# Altium project Final decision and led power V2.PrjPcb
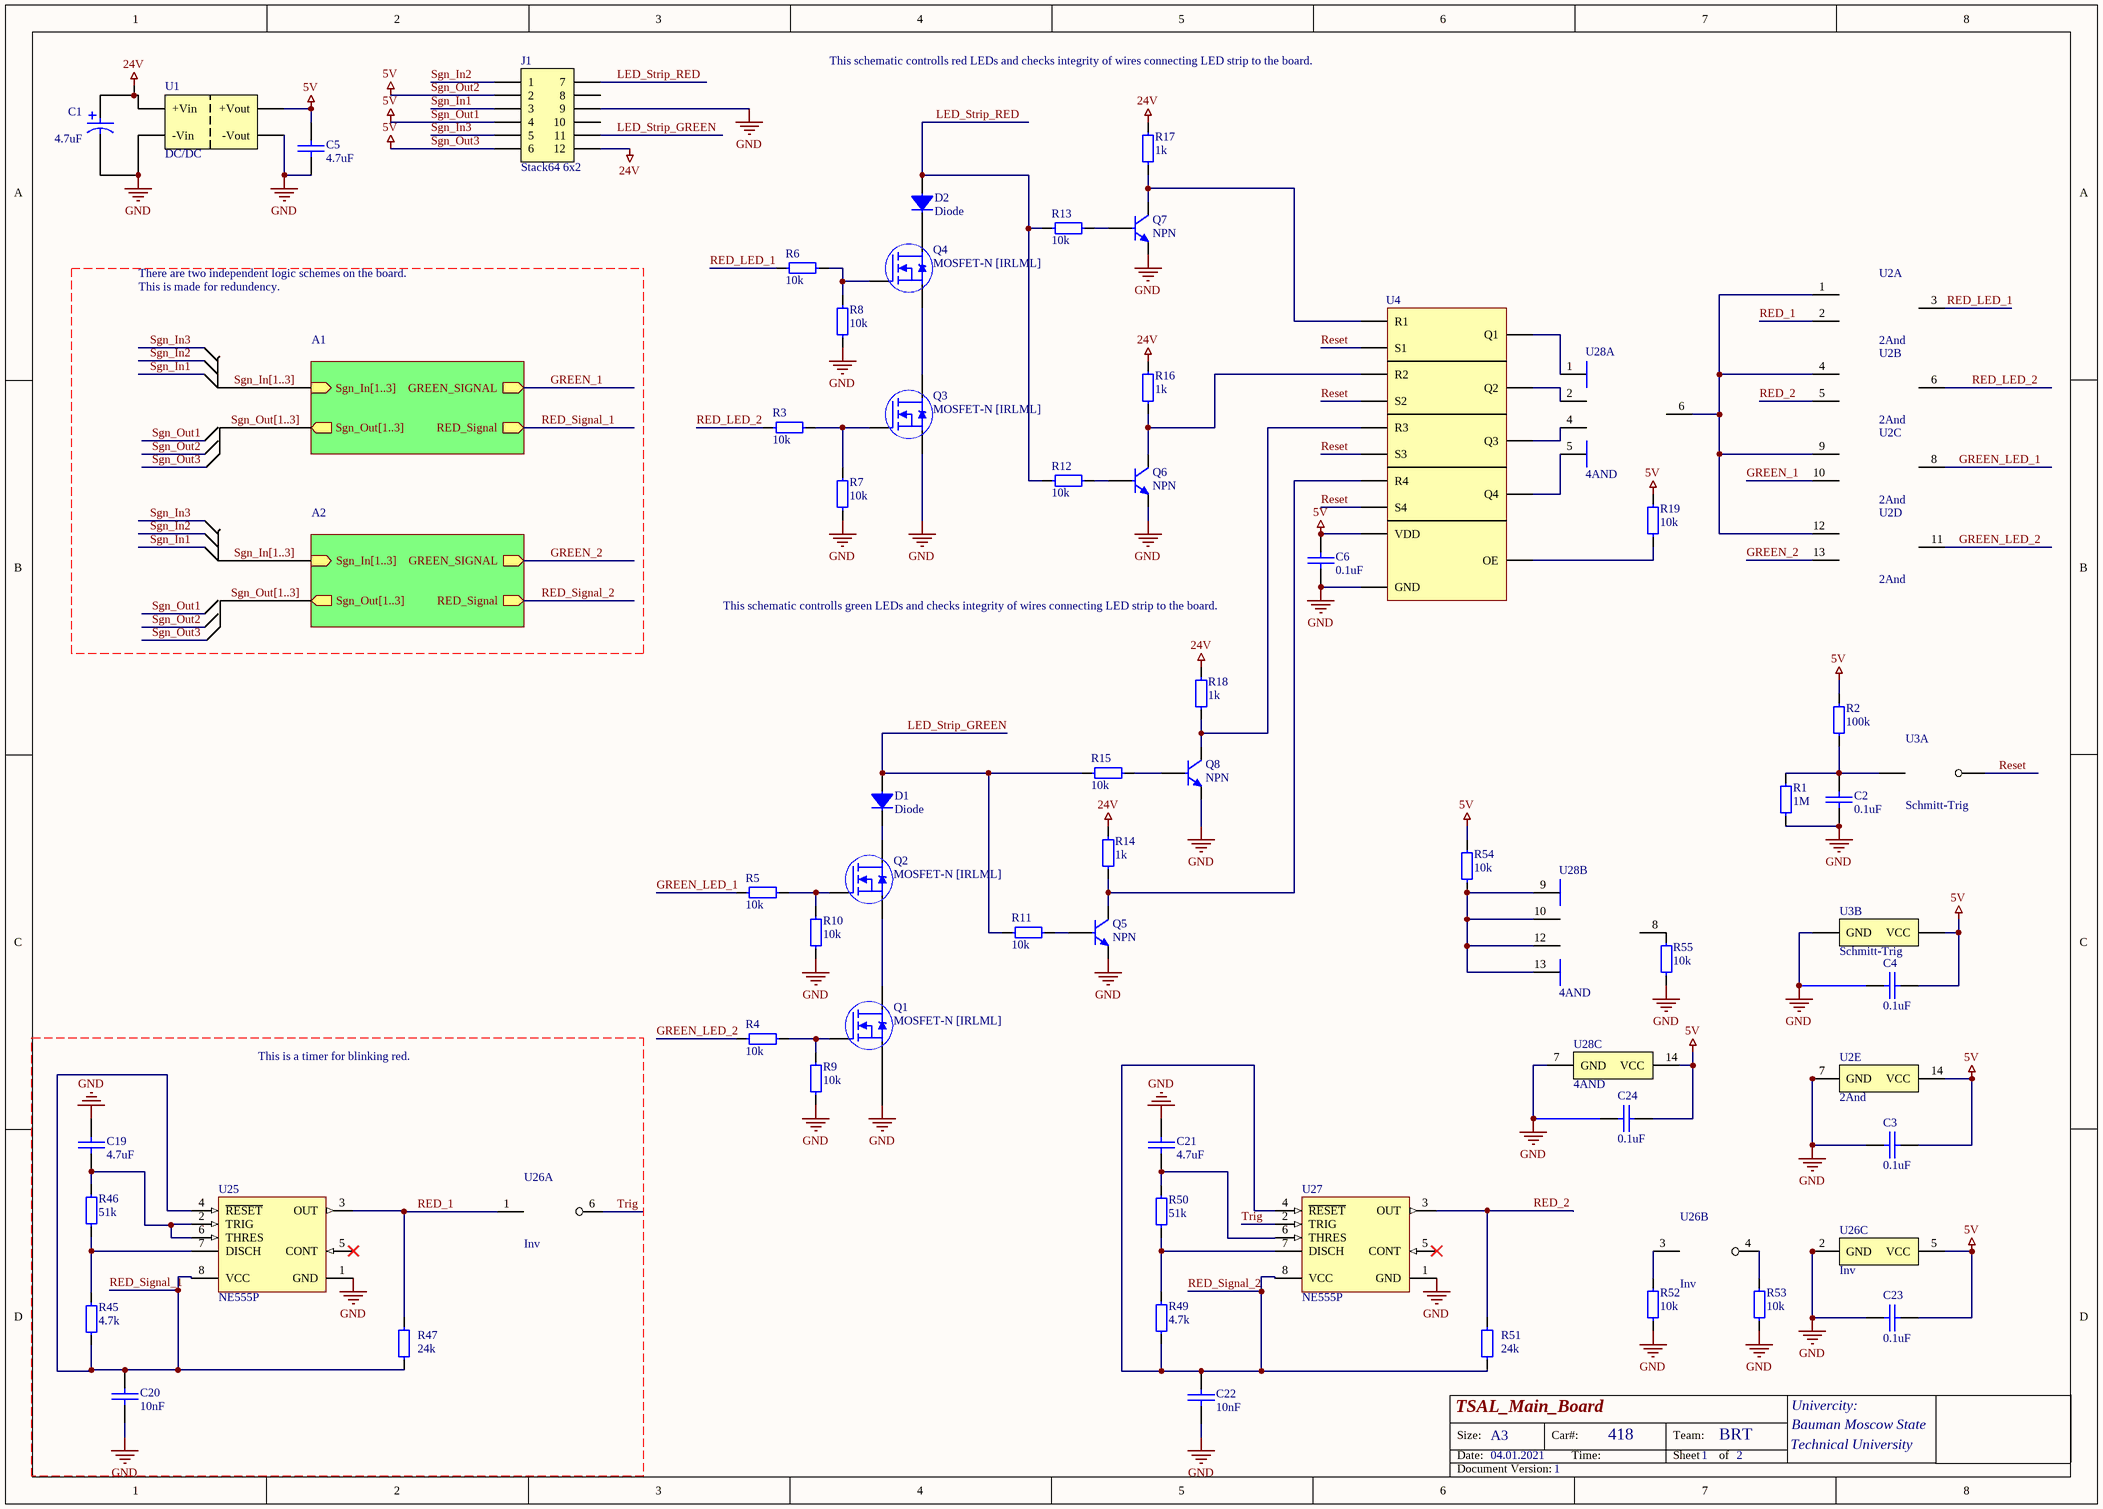
[diagram p0: Sheet1 V2.SchDoc]
2 sheets, 176 parts. Net scope: hierarchical (ports join the sheet entries above them; power ports are global).
Board files: Final decision V4.PcbDoc, Final decision V5.PcbDoc
Sheets:
  Sheet1 V2.SchDoc
    A1 = SignalReciever.SchDoc
    A2 = SignalReciever.SchDoc

## Sheet Sheet1 V2.SchDoc
size A3; Date: 04.01.2021; Organization: Altium Limited; Address1: L3, 12a Rodborough Rd; Address2: Frenchs Forest; Address3: NSW; Address4: Australia 2086; SheetNumber: 1; SheetTotal: 2; Version: 1; Название устройства: TSAL_Main_Board

### Parts
(Parts that share a designator on the sheet are numbered #1, #2 ... from top to bottom, then left to right.)
C1  4.7uF  [Bar Cap 4x5.4]
C2  0.1uF  [0603 Capicator]
C3#1  0.1uF  [0603 Capicator]
C4#1  0.1uF  [0603 Capicator]
C5#1  4.7uF  [0603 Capicator]
C6#1  0.1uF  [0603 Capicator]
C19  4.7uF  [0603 Capicator]
C20  10nF  [0603 Capicator]
C21  4.7uF  [0603 Capicator]
C22  10nF  [0603 Capicator]
C23  0.1uF  [0603 Capicator]
C24  0.1uF  [0603 Capicator]
D1  Diode  [DO-214AB(SMC)]
D2  Diode  [DO-214AB(SMC)]
J1  Stack64 6x2  [Conn6x2(Molex)]
Q1  MOSFET-N [IRLML]  [SOT-23]
Q2  MOSFET-N [IRLML]  [SOT-23]
Q3  MOSFET-N [IRLML]  [SOT-23]
Q4  MOSFET-N [IRLML]  [SOT-23]
Q5  NPN  [SOT-23]
Q6  NPN  [SOT-23]
Q7  NPN  [SOT-23]
Q8  NPN  [SOT-23]
R1  1M  [0603 Resistor]
R2  100k  [0603 Resistor]
R3  10k  [0603 Resistor]
R4  10k  [0603 Resistor]
R5  10k  [0603 Resistor]
R6  10k  [0603 Resistor]
R7  10k  [0603 Resistor]
R8  10k  [0603 Resistor]
R9  10k  [0603 Resistor]
R10  10k  [0603 Resistor]
R11  10k  [0603 Resistor]
R12  10k  [0603 Resistor]
R13  10k  [0603 Resistor]
R14  1k  [0603 Resistor]
R15  10k  [0805 Resistor]
R16  1k  [0603 Resistor]
R17#1  1k  [0603 Resistor]
R18#1  1k  [0603 Resistor]
R19#1  10k  [0603 Resistor]
R45  4.7k  [0603 Resistor]
R46  51k  [0603 Resistor]
R47  24k  [0805 Resistor]
R49  4.7k  [0603 Resistor]
R50  51k  [0603 Resistor]
R51  24k  [0805 Resistor]
R52  10k  [0603 Resistor]
R53  10k  [0603 Resistor]
R54  10k  [0603 Resistor]
R55  10k  [0603 Resistor]
U1  DC/DC  [SIP7]
U2  2And  [SOIC-14]  (parts A,B,C,D,E of 5)
U3  Schmitt-Trig  [SOT-23-5]  (parts A,B of 2)
U4  quad R/S latch with 3-state outputs  [SOIC-16]  (value not drawn)
U25  NE555P  [SOIC-8]
U26  Inv  [SOT236]  (parts A,B,C of 3)
U27  NE555P  [SOIC-8]
U28#1  4AND  [SOIC-14]  (parts A,B,C of 3)

### Sub-sheets
A1 = SignalReciever.SchDoc: RED_Signal (out), GREEN_SIGNAL (out), Sgn_In[1..3] (in), Sgn_Out[1..3] (out)
A2 = SignalReciever.SchDoc: RED_Signal (out), GREEN_SIGNAL (out), Sgn_In[1..3] (in), Sgn_Out[1..3] (out)

### Nets
24V: C1.2 J1.12 R14.2 R16.2 R17#1.2 R18#1.2 U1.1(+Vin)
GND: C1.1 C2.1 C3#1.1 C4#1.1 C5#1.1 C6#1.1 C19.2 C20.1 C21.2 C22.1 C23.1 C24.1 J1.9 Q1.2(Source) Q3.2(Source) Q5.2 Q6.2 Q7.2 Q8.2 R1.1 R7.1 R8.1 R9.1 R10.1 R52.1 R53.2 R55.2 U1.2(-Vin) U1.4(-Vout) U2.7(GND) U3.3(GND) U4.16(GND) U25.1(GND) U26.2(GND) U27.1(GND) U28#1.7(GND)
Sgn_Out1: C3#1.2 C4#1.2 C5#1.2 C6#1.2 C23.2 C24.2 J1.2 J1.4 J1.6 R2.2 R19#1.1 R54.1 U1.6(+Vout) U2.14(VCC) U3.5(VCC) U4.8(VDD) U26.5(VCC) U28#1.14(VCC)  [also labelled 5V, Sgn_Out2, Sgn_Out3]
GREEN_1: U2.10(3B) ; sheet A1/GREEN_SIGNAL
GREEN_2: U2.13(4B) ; sheet A2/GREEN_SIGNAL
GREEN_LED_1: R5.2 U2.8(3Y)
GREEN_LED_2: R4.2 U2.11(4Y)
LED_Strip_GREEN: D1.1 J1.11 R11.2 R15.2
LED_Strip_RED: D2.1 J1.7 R12.2 R13.2
RED_1: R47.2 U2.2(1B) U25.3(OUT) U26.1(1A)
RED_2: R51.2 U2.5(2B) U27.3(OUT)
RED_LED_1: R6.2 U2.3(1Y)
RED_LED_2: R3.2 U2.6(2Y)
RED_Signal_1: C20.2 R45.1 R47.1 U25.4(~{RESET}) U25.8(VCC) ; sheet A1/RED_Signal
RED_Signal_2: C22.2 R49.1 R51.1 U27.4(~{RESET}) U27.8(VCC) ; sheet A2/RED_Signal
Reset: U3.4(Y) U4.4(S1) U4.6(S2) U4.12(S3) U4.14(S4)
Sgn_In1: J1.3
Sgn_In2: J1.1
Sgn_In3: J1.5
Trig: U26.6(1Y) U27.2(TRIG)
NetC2_2: C2.2 R1.2 R2.1 U3.2(in)
NetC19_1: C19.1 R46.2 U25.2(TRIG) U25.6(THRES)
NetC21_1: C21.1 R50.2 U27.6(THRES)
NetD1_2: D1.2 Q2.3(Drain)
NetD2_2: D2.2 Q4.3(Drain)
NetQ1_1: Q1.1(Gate) R4.1 R9.2
NetQ1_3: Q1.3(Drain) Q2.2(Source)
NetQ2_1: Q2.1(Gate) R5.1 R10.2
NetQ3_1: Q3.1(Gate) R3.1 R7.2
NetQ3_3: Q3.3(Drain) Q4.2(Source)
NetQ4_1: Q4.1(Gate) R6.1 R8.2
NetQ5_1: Q5.1 R11.1
NetQ5_3: Q5.3 R14.1 U4.15(R4)
NetQ6_1: Q6.1 R12.1
NetQ6_3: Q6.3 R16.1 U4.7(R2)
NetQ7_1: Q7.1 R13.1
NetQ7_3: Q7.3 R17#1.1 U4.3(R1)
NetQ8_1: Q8.1 R15.1
NetQ8_3: Q8.3 R18#1.1 U4.11(R3)
NetR19#1_2: R19#1.2 U4.5(OE)
NetR45_2: R45.2 R46.1 U25.7(DISCH)
NetR49_2: R49.2 R50.1 U27.7(DISCH)
NetR52_2: R52.2 U26.3(2А)
NetR53_1: R53.1 U26.4(2Y)
NetR54_2: R54.2 U28#1.9(A) U28#1.10(B) U28#1.12(C) U28#1.13(D)
NetR55_1: R55.1 U28#1.8(Y)
NetU2_1: U2.1(1A) U2.4(2A) U2.9(3A) U2.12(4A) U28#1.6(Y)
NetU4_1: U4.1(Q4) U28#1.5(D)
NetU4_2: U4.2(Q1) U28#1.1(A)
NetU4_9: U4.9(Q2) U28#1.2(B)
NetU4_10: U4.10(Q3) U28#1.4(C)

Not connected (* = marked no-connect by the designer): J1 8 10; U25 5(CONT)*; U27 5(CONT)*

### Buses and harness runs
bus Sgn_In[1..3] = sheet A1/Sgn_In[1..3]
bus Sgn_In[1..3] = sheet A2/Sgn_In[1..3]
bus Sgn_Out[1..3] = sheet A1/Sgn_Out[1..3]
bus Sgn_Out[1..3] = sheet A2/Sgn_Out[1..3]

### Notes on the sheet
- This schematic controlls red LEDs and checks integrity of wires connecting LED strip to the board.
- There are two independent logic schemes on the board.
- This is made for redundency.
- (near C6#1) This schematic controlls green LEDs and checks integrity of wires connecting LED strip to the board.
- This is a timer for blinking red.
- Size:
- Date:
- A3
- Car#:
- Time:
- 418
- Team:
- Sheet
- BRT
- of
- Technical University
- Univercity:
- Bauman Moscow State
- Document Version:

### Library data of the parts
C1 = Cap Pol 4.7uF: ECAP SMD,  35V, 105°C; Part Number: B41121A7475M000; Manufacturer: Epcos; Type: Capacitor; ComponentLink1Description: Chip&Dip; ComponentLink1URL: https://www.chipdip.ru/product/b41121a7475m000
C2 C3#1 C4#1 C6#1 C23 C24 = Cap 0.1uF (0603): 0.1uF X7R 16V 10% 0603; Manufacturer: Murata Manufacturing; Part Number: GRM188R71C104KA01D; Type: Capacitor; ComponentLink1Description: Chip&Dip; ComponentLink1URL: https://www.chipdip.ru/product/grm188r71c104ka01d
C5#1 C19 C21 = Cap 4.7uF (0603): 4.7uF X5R 25V 10% 0603; Manufacturer: Murata Manufacturing; Part Number: GRM188R61E475KE11D; Type: Capacitor; ComponentLink1Description: Chip&Dip; ComponentLink1URL: https://www.chipdip.ru/product0/9000348448
C20 C22 = Cap 10nF (0603): X7R 10nF 100V 10% 0603; Manufacturer: Murata Manufacturing; Part Number: GRM188R72A103KA01D; Type: Capacitor; ComponentLink1Description: Chip&Dip; ComponentLink1URL: https://www.chipdip.ru/product/grm188r72a103ka01d
D1 D2 = Diode (SMC): 3A 50V, (DO-214AB/SMC); Part Number: GS3A; Manufacturer: Yangzhou Yangjie Electronic Technology; Type: Diode; ComponentLink1Description: DataSheet; ComponentLink1URL: https://static.chipdip.ru/lib/152/DOC001152906.pdf; ComponentLink2Description: Chip&Dip; ComponentLink2URL: https://www.chipdip.ru/product/gs3a
J1 = Conn 12 [Stack64]: Stac64 Right-Angle Header Assembly, 12 Circuits, Polarization A, Black, Tray / Current - Maximum per Contact 10.0A / Voltage - Maximum 500V; ComponentLink1Description: Molex; ComponentLink1URL: https://www.molex.com/molex/products/part-detail/pcb_headers/0346910120; ComponentLink2Description: DataSheet; ComponentLink2URL: https://www.molex.com/webdocs/datasheets/pdf/en-us/0346910120_PCB_HEADERS.pdf
Q1-Q4 = MOSFET-N [IRLML]: VDS 30V,  VGS Max ± 20V, RDS 27-40mΩ,; Part Number: IRLML0030TRPBF; Manufacturer: Infineon Technologies; Type: Transistor; ComponentLink1Description: DataSheet; ComponentLink1URL: https://static.chipdip.ru/lib/300/DOC000300382.pdf; ComponentLink2Description: Chip&Dip; ComponentLink2URL: https://www.chipdip.ru/product/irlml0030trpbf
Q5-Q8 = NPN [BC817]: NPN general-purpose transistors; Part Number: BC817-40,215; Manufacturer: Nexperia; Type: Transistor; ComponentLink1Description: DataSheet; ComponentLink1URL: https://static.chipdip.ru/lib/156/DOC000156781.pdf; ComponentLink2Description: Chip&Dip; ComponentLink2URL: https://www.chipdip.ru/product/bc817-40
R1 = Res 1M (0603): 0.1W 0603 1M, 1%; Part Number: RC0603FR-071ML; Manufacturer: Taiwan; Type: Resistor; ComponentLink1Description: Chip&Dip; ComponentLink1URL: https://www.chipdip.ru/product0/9000079784
R2 = Res 100k (0603): 0.1W 0603 100k, 1%; Part Number: RC0603FR-07100KL; Manufacturer: Taiwan; Type: Resistor; ComponentLink1Description: Chip&Dip; ComponentLink1URL: https://www.chipdip.ru/product0/9000079760
R3-R13 R19#1 R52-R55 = Res 10k (0603): 0.1W 0603 10k, 1%; Part Number: RC0603FR-0710KL; Manufacturer: Taiwan; Type: Resistor; ComponentLink1Description: Chip&Dip; ComponentLink1URL: https://www.chipdip.ru/product0/9000079736
R14 R16 R17#1 R18#1 = Res 1k (0603): 0.1W 0603 1k, 1%; Part Number: RC0603FR-071KL; Manufacturer: Taiwan; Type: Resistor; ComponentLink1Description: Chip&Dip; ComponentLink1URL: https://www.chipdip.ru/product0/9000079676
R15 = Res 10k (0805): 0.125W 0805 10k, 1%; Part Number: RC0805FR-0710KL; Manufacturer: Taiwan; Type: Resistor; ComponentLink1Description: Chip&Dip; ComponentLink1URL: https://www.chipdip.ru/product0/9000079514
R45 R49 = Res 4.7k (0603): 0.1W 0603 4.7k, 1%; Part Number: RC0603FR-074K7L; Manufacturer: Taiwan; Type: Resistor; ComponentLink1Description: Chip&Dip; ComponentLink1URL: https://www.chipdip.ru/product0/9000079728
R46 R50 = Res 51k (0603): 0.1W 0603 51k, 1%; Part Number: RC0603FR-0751KL; Manufacturer: Taiwan; Type: Resistor; ComponentLink1Description: Chip&Dip; ComponentLink1URL: https://www.chipdip.ru/product0/9000079753
R47 R51 = Res 24k (0805): 0.125W 0805 24k, 1%; Part Number: RC0805FR-0724KL; Manufacturer: Taiwan; Type: Resistor; ComponentLink1Description: Chip&Dip; ComponentLink1URL: https://www.chipdip.ru/product0/9000079523
U1 = DC/DC Isolated 24V-5V [TMH]: The TMH series are ultra miniature, isolated 2 Watt DC/DC-converters in a Single-in-Line  package  (SIP); Manufacturer: Traco Power; Part Number: TMH2405S; ComponentLink1Description: Chip&Dip; ComponentLink1URL: https://www.chipdip.ru/product/tmh-2405s; ComponentLink2Description: DataSheet; ComponentLink2URL: https://static.chipdip.ru/lib/005/DOC001005854.pdf; Type: IC
U2 = 4(2And): 4 logic elements "2AND"; Part Number: SN74AC08DR; Manufacturer: Texas Instruments; ComponentLink1Description: DataSheet; ComponentLink1URL: https://static.chipdip.ru/lib/551/DOC001551527.pdf; ComponentLink2Description: Chip&Dip; ComponentLink2URL: https://www.chipdip.ru/product/sn74ac08dr; Type: IC
U3 = Schmitt Trigger [NC7SZ]: The NC7SZ14M5X is a single Inverter with Schmitt-trigger input from ultra-high speed (UHS) series of TinyLogic®. The device is fabricated with advanced CMOS technology to achieve ultra-high speed with high output drive while maintaining low static power dissipation over a very broad VCC operating range. The device is specified to operate over the 1.65 to 5.5V VCC range. The inputs and outputs are high-impedance when VCC is 0V. Inputs tolerate voltages up to 6V independent of VCC operating voltage.; Manufacturer: ON Semiconductor; Part Number: NC7SZ14M5X; ComponentLink1Description: DataSheet; ComponentLink1URL: https://static.chipdip.ru/lib/321/DOC000321280.pdf; ComponentLink2Description: Chip&Dip; ComponentLink2URL: https://www.chipdip.ru/product/nc7sz14m5x; Type: IC
U4 = 4 RS triggers: The HEF4043B is a quad R/S latch with 3-state outputs and common output enable input (OE).; ComponentLink1Description: Datasheet; ComponentLink1URL: https://static.chipdip.ru/lib/486/DOC014486419.pdf; ComponentLink2Description: CHIPDIP; ComponentLink2URL: https://www.chipdip.ru/product/hef4043bt-652-nexperia
U25 U27 = NE555P: Standard Timer Single 8-Pin PDIP Tube; Manufacturer: Texas Instruments; Min Supply Voltage: 4.5V; Max Supply Voltage: 16V; Frequency: 500kHz; Number of Timers/Counters: 1; High Level Output Current: -200mA; Low Level Output Current: 200mA; Nominal Supply Current: 2mA; Operating Supply Current: 10mA; Quiescent Current: 15mA; Operating Supply Voltage: 5V; Supplier 1: Digi-Key; Manufacturer Part Number: NE555P; RoHS: Yes; Category: Clock and Timing; Pricing 1: 1=0,37000, 10=0,29900, 25=0,27360, 100=0,20350, 250=0,18444, 500=0,15264, 1000=0,11448, 2500=0,10494, 5000=0,10020 (USD); Mount: SMD; Case/Package: PDIP; Number of Pins: 8; Weight: 0.015535oz; Contact Plating: Gold; Min Operating Temperature: 0°C; Max Operating Temperature: 70°C; Packaging: Rail/Tube; Package Quantity: 50; Current Rating: 10mA; Length: 9.81mm; Width: 6.35mm; Height: 4.57mm; Radiation Hardening: No; Lead Free: Lead Free; RoHS Compliant: Yes; REACH SVHC: No SVHC; ComponentLink1URL: https://datasheet.ciiva.com/1139/sa555-1139904.pdf?src-supplier=Element14; ComponentLink1Description: https://datasheet.ciiva.com/1139/sa555-1139904.pdf?src-supplier=Element14; ComponentLink2URL: https://datasheet.ciiva.com/19457/904085-19457361.pdf?src-supplier=Jameco; ComponentLink2Description: https://datasheet.ciiva.com/19457/904085-19457361.pdf?src-supplier=Jameco; ComponentLink3URL: https://datasheet.ciiva.com/26325/152184-da-01-en-ne555p-timer-tid-26325915.pdf?src-supplier=Conrad; ComponentLink3Description: https://datasheet.ciiva.com/26325/152184-da-01-en-ne555p-timer-tid-26325915.pdf?src-supplier=Conrad; ComponentLink4URL: https://datasheet.ciiva.com/1147/1764032-1147750.pdf?src-supplier=Newark; ComponentLink4Description: https://datasheet.ciiva.com/1147/1764032-1147750.pdf?src-supplier=Newark; ComponentLink5URL: https://datasheet.ciiva.com/14094/ne555-series-eng-tds-14094950.pdf?src-supplier=Distrelec; ComponentLink5Description: https://datasheet.ciiva.com/14094/ne555-series-eng-tds-14094950.pdf?src-supplier=Distrelec; ComponentLink6URL: https://datasheet.ciiva.com/14274/ne555-14274456.pdf?src-supplier=Avnet; ComponentLink6Description: https://datasheet.ciiva.com/14274/ne555-14274456.pdf?src-supplier=Avnet; ComponentLink7URL: https://datasheet.ciiva.com/15152/getdatasheetpartid-248510-15152620.pdf?src-supplier=Verical; ComponentLink7Description: https://datasheet.ciiva.com/15152/getdatasheetpartid-248510-15152620.pdf?src-supplier=Verical; ComponentLink8URL: https://datasheet.ciiva.com/1233/ne555-1233454.pdf?src-supplier=Digi-Key; ComponentLink8Description: https://datasheet.ciiva.com/1233/ne555-1233454.pdf?src-supplier=Digi-Key; ComponentLink9URL: https://datasheet.ciiva.com/26228/ne555-26228892.pdf?src-supplier=Avnet+Europe; ComponentLink9Description: https://datasheet.ciiva.com/26228/ne555-26228892.pdf?src-supplier=Avnet+Europe
U26 = Inverter (SN74): Dual inverter, 1.65-5.5V; Manufacturer: Texas Instruments; Part Number: SN74LVC2G04DBVR; ComponentLink1Description: Chip&Dip; ComponentLink1URL: https://www.chipdip.ru/product/sn74lvc2g04dbvr-2; ComponentLink2Description: DataSheet; ComponentLink2URL: https://static.chipdip.ru/lib/021/DOC001021810.pdf; Type: IC
U28#1 = 2(4AND): 2 logic elements "4AND"; Part Number: 74HC21D,653; Manufacturer: Nexperia; ComponentLink1Description: Chip&Dip; ComponentLink1URL: https://www.chipdip.ru/product/74hc21d.653; Type: IC; ComponentLink2Description: DataSheet; ComponentLink2URL: https://static.chipdip.ru/lib/522/DOC011522559.pdf

## Sheet SignalReciever.SchDoc
size A2; ENG_APP_DATE: --/--/--; DSN_APP_DATE: --/--/--; CHK_APP_DATE: --/--/--; Date: 04.01.2021; Organization: Altium Limited; Address1: L3, 12a Rodborough Rd; Address2: Frenchs Forest; Address3: NSW; Address4: Australia 2086; SheetNumber: 2; SheetTotal: 2; Название устройства: Reciever; Version: 1
Used 2 times, as channels A1, A2. Parts and nets are listed once, with the designators drawn on the sheet.
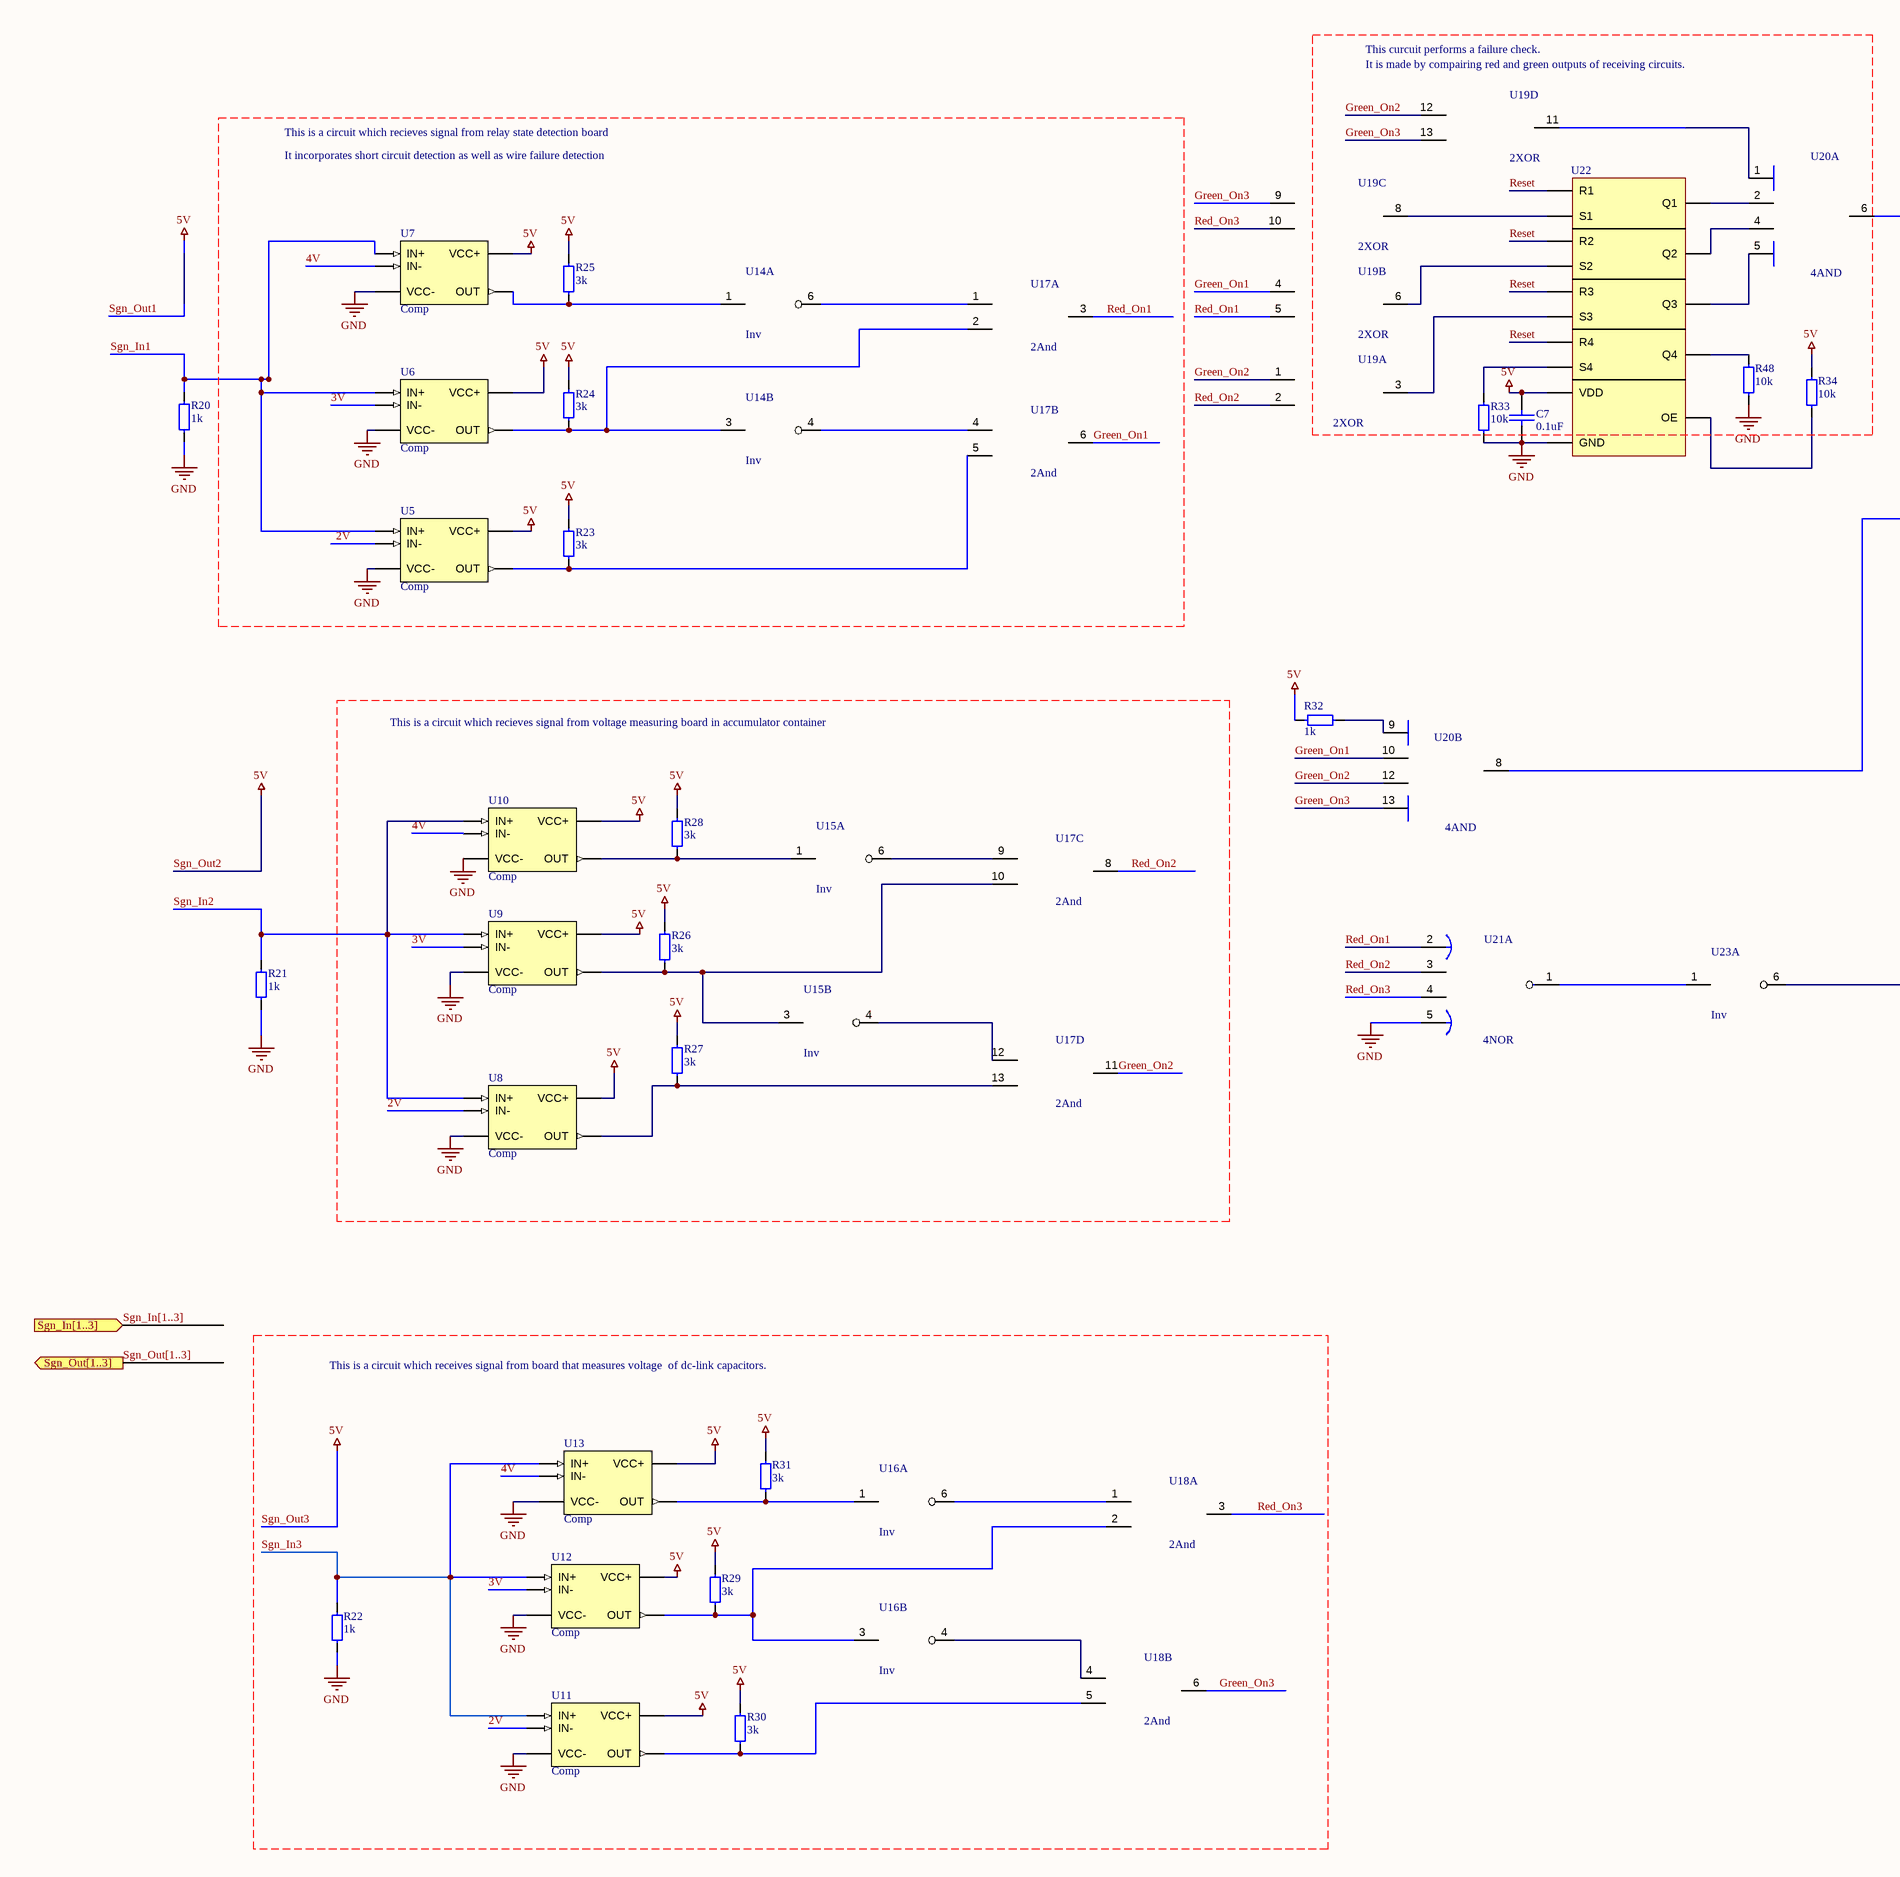
[diagram p1: SignalReciever.SchDoc, left]
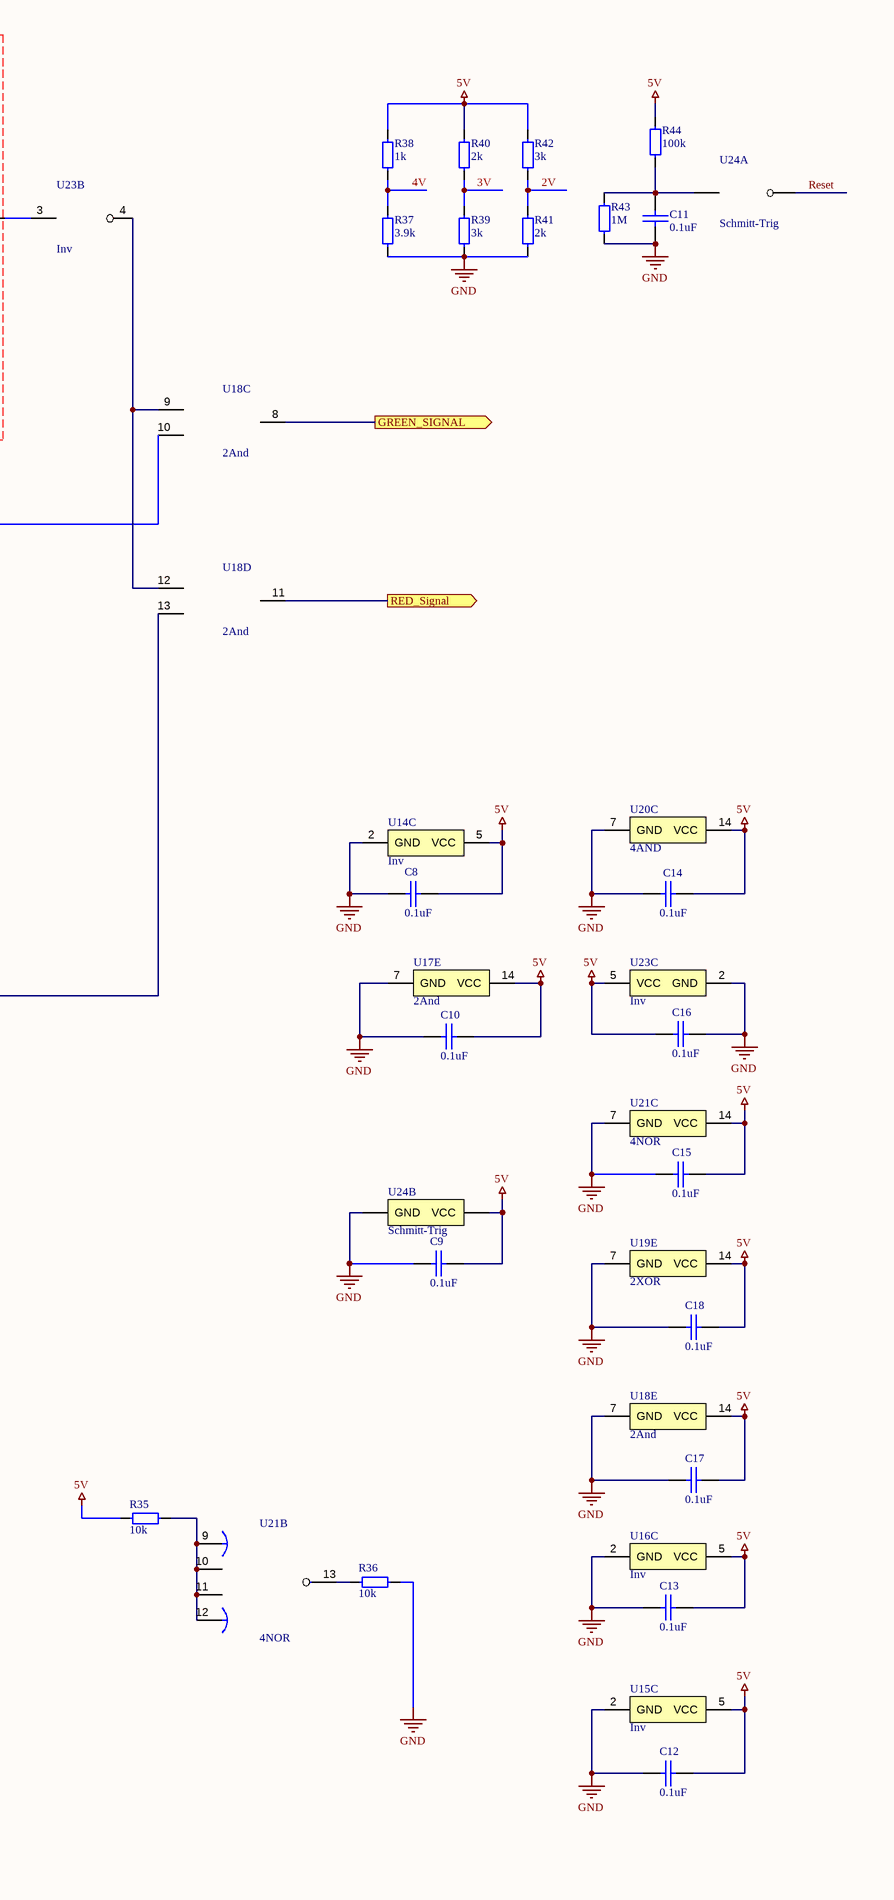
[diagram p2: SignalReciever.SchDoc, right]

### Parts
C7  0.1uF  [0603 Capicator]
C8  0.1uF  [0603 Capicator]
C9  0.1uF  [0603 Capicator]
C10  0.1uF  [0603 Capicator]
C11  0.1uF  [0603 Capicator]
C12  0.1uF  [0603 Capicator]
C13  0.1uF  [0603 Capicator]
C14  0.1uF  [0603 Capicator]
C15  0.1uF  [0603 Capicator]
C16  0.1uF  [0603 Capicator]
C17  0.1uF  [0603 Capicator]
C18  0.1uF  [0603 Capicator]
R20  1k  [0603 Resistor]
R21  1k  [0603 Resistor]
R22  1k  [0603 Resistor]
R23  3k  [0603 Resistor]
R24  3k  [0603 Resistor]
R25  3k  [0603 Resistor]
R26  3k  [0603 Resistor]
R27  3k  [0603 Resistor]
R28  3k  [0603 Resistor]
R29  3k  [0603 Resistor]
R30  3k  [0603 Resistor]
R31  3k  [0603 Resistor]
R32  1k  [0603 Resistor]
R33  10k  [0603 Resistor]
R34  10k  [0603 Resistor]
R35  10k  [0603 Resistor]
R36  10k  [0603 Resistor]
R37  3.9k  [0603 Resistor]
R38  1k  [0603 Resistor]
R39  3k  [0603 Resistor]
R40  2k  [0603 Resistor]
R41  2k  [0603 Resistor]
R42  3k  [0603 Resistor]
R43  1M  [0603 Resistor]
R44  100k  [0603 Resistor]
R48  10k  [0603 Resistor]
U5  Comp  [SOT-23-5]
U6  Comp  [SOT-23-5]
U7  Comp  [SOT-23-5]
U8  Comp  [SOT-23-5]
U9  Comp  [SOT-23-5]
U10  Comp  [SOT-23-5]
U11  Comp  [SOT-23-5]
U12  Comp  [SOT-23-5]
U13  Comp  [SOT-23-5]
U14  Inv  [SOT236]  (parts A,B,C of 3)
U15  Inv  [SOT236]  (parts A,B,C of 3)
U16  Inv  [SOT236]  (parts A,B,C of 3)
U17  2And  [SOIC-14]  (parts A,B,C,D,E of 5)
U18  2And  [SOIC-14]  (parts A,B,C,D,E of 5)
U19  2XOR  [SOIC-14]  (parts A,B,C,D,E of 5)
U20  4AND  [SOIC-14]  (parts A,B,C of 3)
U21  4NOR  [SOIC-14]  (parts A,B,C of 3)
U22  quad R/S latch with 3-state outputs  [SOIC-16]  (value not drawn)
U23  Inv  [SOT236]  (parts A,B,C of 3)
U24  Schmitt-Trig  [SOT-23-5]  (parts A,B of 2)

### Ports
GREEN_SIGNAL (out), RED_Signal (out), Sgn_In[1..3] (in), Sgn_Out[1..3] (out)

### Nets
GND: C7.1 C8.1 C9.1 C10.1 C11.1 C12.1 C13.1 C14.1 C15.1 C16.2 C17.1 C18.1 R20.1 R21.1 R22.1 R33.2 R36.2 R37.1 R39.1 R41.1 R43.1 R48.2 U5.2(VCC-) U6.2(VCC-) U7.2(VCC-) U8.2(VCC-) U9.2(VCC-) U10.2(VCC-) U11.2(VCC-) U12.2(VCC-) U13.2(VCC-) U14.2(GND) U15.2(GND) U16.2(GND) U17.7(GND) U18.7(GND) U19.7(GND) U20.7(GND) U21.5(D) U21.7(GND) U22.16(GND) U23.2(GND) U24.3(GND)
Sgn_Out1: C7.2 C8.2 C9.2 C10.2 C12.2 C13.2 C14.2 C15.2 C16.1 C17.2 C18.2 R23.2 R24.2 R25.2 R26.2 R27.2 R28.2 R29.2 R30.2 R31.2 R32.2 R34.1 R35.1 R38.1 R40.2 R42.2 R44.2 U5.5(VCC+) U6.5(VCC+) U7.5(VCC+) U8.5(VCC+) U9.5(VCC+) U10.5(VCC+) U11.5(VCC+) U12.5(VCC+) U13.5(VCC+) U14.5(VCC) U15.5(VCC) U16.5(VCC) U17.14(VCC) U18.14(VCC) U19.14(VCC) U20.14(VCC) U21.14(VCC) U22.8(VDD) U23.5(VCC) U24.5(VCC)  [also labelled 5V, Sgn_Out2, Sgn_Out3]
2V: R41.2 R42.1 U5.3(IN-) U8.3(IN-) U11.3(IN-)
3V: R39.2 R40.1 U6.3(IN-) U9.3(IN-) U12.3(IN-)
4V: R37.2 R38.2 U7.3(IN-) U10.3(IN-) U13.3(IN-)
Green_On1: U17.6(2Y) U19.4(A) U20.10(B)
Green_On2: U17.11(4Y) U19.1(A) U19.12(A) U20.12(C)
Green_On3: U18.6(2Y) U19.9(A) U19.13(B) U20.13(D)
GREEN_SIGNAL: U18.8(3Y) ; port GREEN_SIGNAL
Red_On1: U17.3(1Y) U19.5(B) U21.2(A)
Red_On2: U17.8(3Y) U19.2(B) U21.3(B)
Red_On3: U18.3(1Y) U19.10(B) U21.4(C)
RED_Signal: U18.11(4Y) ; port RED_Signal
Reset: U22.3(R1) U22.7(R2) U22.11(R3) U22.15(R4) U24.4(Y)
Sgn_In1: R20.2 U5.1(IN+) U6.1(IN+) U7.1(IN+)
Sgn_In2: R21.2 U8.1(IN+) U9.1(IN+) U10.1(IN+)
Sgn_In3: R22.2 U11.1(IN+) U12.1(IN+) U13.1(IN+)
NetC11_2: C11.2 R43.2 R44.1 U24.2(in)
NetR23_1: R23.1 U5.4(OUT) U17.5(2B)
NetR24_1: R24.1 U6.4(OUT) U14.3(2А) U17.2(1B)
NetR25_1: R25.1 U7.4(OUT) U14.1(1A)
NetR26_1: R26.1 U9.4(OUT) U15.3(2А) U17.10(3B)
NetR27_1: R27.1 U8.4(OUT) U17.13(4B)
NetR28_1: R28.1 U10.4(OUT) U15.1(1A)
NetR29_1: R29.1 U12.4(OUT) U16.3(2А) U18.2(1B)
NetR30_1: R30.1 U11.4(OUT) U18.5(2B)
NetR31_1: R31.1 U13.4(OUT) U16.1(1A)
NetR32_1: R32.1 U20.9(A)
NetR33_1: R33.1 U22.14(S4)
NetR34_2: R34.2 U22.5(OE)
NetR35_2: R35.2 U21.9(A) U21.10(B) U21.11(C) U21.12(D)
NetR36_1: R36.1 U21.13(Y)
NetR48_1: R48.1 U22.1(Q4)
NetU14_4: U14.4(2Y) U17.4(2A)
NetU14_6: U14.6(1Y) U17.1(1A)
NetU15_4: U15.4(2Y) U17.12(4A)
NetU15_6: U15.6(1Y) U17.9(3A)
NetU16_4: U16.4(2Y) U18.4(2A)
NetU16_6: U16.6(1Y) U18.1(1A)
NetU18_9: U18.9(3A) U18.12(4A) U23.4(2Y)
NetU18_10: U18.10(3B) U20.8(Y)
NetU18_13: U18.13(4B) U23.6(1Y)
NetU19_3: U19.3(Y) U22.12(S3)
NetU19_6: U19.6(Y) U22.6(S2)
NetU19_8: U19.8(Y) U22.4(S1)
NetU19_11: U19.11(Y) U20.1(A)
NetU20_2: U20.2(B) U22.2(Q1)
NetU20_4: U20.4(C) U22.9(Q2)
NetU20_5: U20.5(D) U22.10(Q3)
NetU20_6: U20.6(Y) U23.3(2А)
NetU21_1: U21.1(Y) U23.1(1A)

### Channels
A1: designators C7=C7_A1 C8=C4#2 C9=C9_A1 C10=C5#2 C11=C11_A1 C12=C9#1 C13=C3#2 C14=C10#1 C15=C6#2 C16=C11#1 C17=C7#1 C18=C8#1 R20=R17#2 R21=R18#2 R22=R19#2 R23=R33#1 R24=R34#1 R25=R35#1 R26=R37#1 R27=R38#1 R28=R39#1 R29=R31#1 R30=R36#1 R31=R40#1 R32=R20#1 R33=R33_A1 R34=R34_A1 R35=R21#1 R36=R22#1 R37=R24#1 R38=R23#1 R39=R26#1 R40=R25#1 R41=R28#1 R42=R27#1 R43=R43_A1 R44=R44_A1 R48=R48_A1 U5=U17#1 U6=U16#1 U7=U15#1 U8=U20#1 U9=U19#1 U10=U18#1 U11=U14#1 U12=U13#1 U13=U12#1 U14=U5#1 U15=U21#1 U16=U23#1 U17=U28#2 U18=U29#1 U19=U36#1 U20=U45#1 U21=U41#1 U22=U22_A1 U23=U43#1 U24=U24_A1; ports GREEN_SIGNAL=GREEN_1 RED_Signal=RED_Signal_1
A2: designators C7=C7_A2 C8=C4#3 C9=C9_A2 C10=C5#3 C11=C11_A2 C12=C9#2 C13=C3#3 C14=C10#2 C15=C6#3 C16=C11#2 C17=C7#2 C18=C8#2 R20=R17#3 R21=R18#3 R22=R19#3 R23=R33#2 R24=R34#2 R25=R35#2 R26=R37#2 R27=R38#2 R28=R39#2 R29=R31#2 R30=R36#2 R31=R40#2 R32=R20#2 R33=R33_A2 R34=R34_A2 R35=R21#2 R36=R22#2 R37=R24#2 R38=R23#2 R39=R26#2 R40=R25#2 R41=R28#2 R42=R27#2 R43=R43_A2 R44=R44_A2 R48=R48_A2 U5=U17#2 U6=U16#2 U7=U15#2 U8=U20#2 U9=U19#2 U10=U18#2 U11=U14#2 U12=U13#2 U13=U12#2 U14=U5#2 U15=U21#2 U16=U23#2 U17=U28#3 U18=U29#2 U19=U36#2 U20=U45#2 U21=U41#2 U22=U22_A2 U23=U43#2 U24=U24_A2; ports GREEN_SIGNAL=GREEN_2 RED_Signal=RED_Signal_2

### Buses and harness runs
bus Sgn_In[1..3] = port Sgn_In[1..3]
bus Sgn_Out[1..3] = port Sgn_Out[1..3]

### Notes on the sheet
- This curcuit performs a failure check.
- (near U19) It is made by compairing red and green outputs of receiving circuits.
- This is a circuit which recieves signal from relay state detection board
- It incorporates short circuit detection as well as wire failure detection
- This is a circuit which recieves signal from voltage measuring board in accumulator container
- This is a circuit which receives signal from board that measures voltage  of dc-link capacitors.
- Univercity:
- Size:
- Date:
- Document Version:
- A3
- Car#:
- Time:
- 418
- Team:
- Sheet
- BRT
- of
- Technical University
- Bauman Moscow State

### Library data of the parts
C7-C18 = Cap 0.1uF (0603): as C2 on sheet Sheet1 V2; ComponentLink1Description: Chip&Dip; ComponentLink1URL: https://www.chipdip.ru/product/grm188r71c104ka01d
R20-R22 R32 R38 = Res 1k (0603): as R14 on sheet Sheet1 V2; Type: Resistor; ComponentLink1Description: Chip&Dip; ComponentLink1URL: https://www.chipdip.ru/product0/9000079676
R23-R31 R39 R42 = Res 3k (0603): 0.1W 0603 3k, 1%; Part Number: RC0603FR-073KL; Manufacturer: Taiwan; Type: Resistor; ComponentLink1Description: Chip&Dip; ComponentLink1URL: https://www.chipdip.ru/product0/9000079723
R33-R36 R48 = Res 10k (0603): as R3 on sheet Sheet1 V2; Type: Resistor; ComponentLink1Description: Chip&Dip; ComponentLink1URL: https://www.chipdip.ru/product0/9000079736
R37 = Res 3.9k (0603): 0.1W 0603 3.9k, 1%; Part Number: RC0603FR-073K9L; Manufacturer: Taiwan; Type: Resistor; ComponentLink1Description: Chip&Dip; ComponentLink1URL: https://www.chipdip.ru/product0/9000079726
R40 R41 = Res 2k (0603): 0.1W 0603 2k, 1%; Part Number: RC0603FR-072KL; Manufacturer: Taiwan; Type: Resistor; ComponentLink1Description: Chip&Dip; ComponentLink1URL: https://www.chipdip.ru/product0/9000079719
R43 = Res 1M (0603): as R1 on sheet Sheet1 V2; Type: Resistor; ComponentLink1Description: Chip&Dip; ComponentLink1URL: https://www.chipdip.ru/product0/9000079784
R44 = Res 100k (0603): as R2 on sheet Sheet1 V2; Type: Resistor; ComponentLink1Description: Chip&Dip; ComponentLink1URL: https://www.chipdip.ru/product0/9000079760
U5-U13 = Comparator [LMV]: Differential comparator with strobes; Part Number: LMV331M5/NOPB; Manufacturer: Texas Instruments; ComponentLink1Description: DataSheet; ComponentLink1URL: https://static.chipdip.ru/lib/291/DOC000291302.pdf; ComponentLink2Description: Chip&Dip; ComponentLink2URL: https://www.chipdip.ru/product/lmv331m5-nopb; Type: IC
U14-U16 U23 = Inverter (SN74): as U26 on sheet Sheet1 V2; ComponentLink1Description: Chip&Dip; ComponentLink1URL: https://www.chipdip.ru/product/sn74lvc2g04dbvr-2; ComponentLink2Description: DataSheet; ComponentLink2URL: https://static.chipdip.ru/lib/021/DOC001021810.pdf; Type: IC
U17 U18 = 4(2And): as U2 on sheet Sheet1 V2; ComponentLink1Description: DataSheet; ComponentLink1URL: https://static.chipdip.ru/lib/551/DOC001551527.pdf; ComponentLink2Description: Chip&Dip; ComponentLink2URL: https://www.chipdip.ru/product/sn74ac08dr; Type: IC
U19 = 4(2XOR): 4 logic elements "2XOR"; Part Number: 74HC86D,653; Manufacturer: Nexperia; ComponentLink1Description: Chip&Dip; ComponentLink1URL: https://www.chipdip.ru/product/74hc86d; Type: IC; ComponentLink2Description: DataSheet; ComponentLink2URL: https://ru.mouser.com/datasheet/2/916/74HC_HCT86-1319799.pdf
U20 = 2(4AND): as U28#1 on sheet Sheet1 V2; ComponentLink1Description: Chip&Dip; ComponentLink1URL: https://www.chipdip.ru/product/74hc21d.653; Type: IC; ComponentLink2Description: DataSheet; ComponentLink2URL: https://static.chipdip.ru/lib/522/DOC011522559.pdf
U21 = 2(4NOR): 2 logic elements "4NOR"; Part Number: 74HC4002D,652; Manufacturer: Nexperia; ComponentLink1Description: Chip&Dip; ComponentLink1URL: https://www.chipdip.ru/product/74hc4002d; Type: IC; ComponentLink2Description: DataSheet; ComponentLink2URL: https://static.chipdip.ru/lib/493/DOC011493188.pdf
U22 = 4 RS triggers: as U4 on sheet Sheet1 V2; ComponentLink1Description: Datasheet; ComponentLink1URL: https://static.chipdip.ru/lib/486/DOC014486419.pdf; ComponentLink2Description: CHIPDIP; ComponentLink2URL: https://www.chipdip.ru/product/hef4043bt-652-nexperia
U24 = Schmitt Trigger [NC7SZ]: as U3 on sheet Sheet1 V2; Part Number: NC7SZ14M5X; ComponentLink1Description: DataSheet; ComponentLink1URL: https://static.chipdip.ru/lib/321/DOC000321280.pdf; ComponentLink2Description: Chip&Dip; ComponentLink2URL: https://www.chipdip.ru/product/nc7sz14m5x; Type: IC

## Nets that join several sheets
GND: Sheet1 V2 (36 pins), A1 (43 pins), A2 (43 pins)
Sgn_Out1: Sheet1 V2 (18 pins), A1 (47 pins), A2 (47 pins)
GREEN_1: Sheet1 V2 (U2.10), A1 (U29#1.8)
GREEN_2: Sheet1 V2 (U2.13), A2 (U29#2.8)
RED_Signal_1: Sheet1 V2 (5 pins), A1 (U29#1.11)
RED_Signal_2: Sheet1 V2 (5 pins), A2 (U29#2.11)
Sgn_In1: Sheet1 V2 (J1.3), A1 (R17#2.2 U15#1.1 U16#1.1 U17#1.1), A2 (R17#3.2 U15#2.1 U16#2.1 U17#2.1)
Sgn_In2: Sheet1 V2 (J1.1), A1 (R18#2.2 U18#1.1 U19#1.1 U20#1.1), A2 (R18#3.2 U18#2.1 U19#2.1 U20#2.1)
Sgn_In3: Sheet1 V2 (J1.5), A1 (R19#2.2 U12#1.1 U13#1.1 U14#1.1), A2 (R19#3.2 U12#2.1 U13#2.1 U14#2.1)